# EAGLE board dc26-dev-board-apa102c (EAGLE 8.6.3)
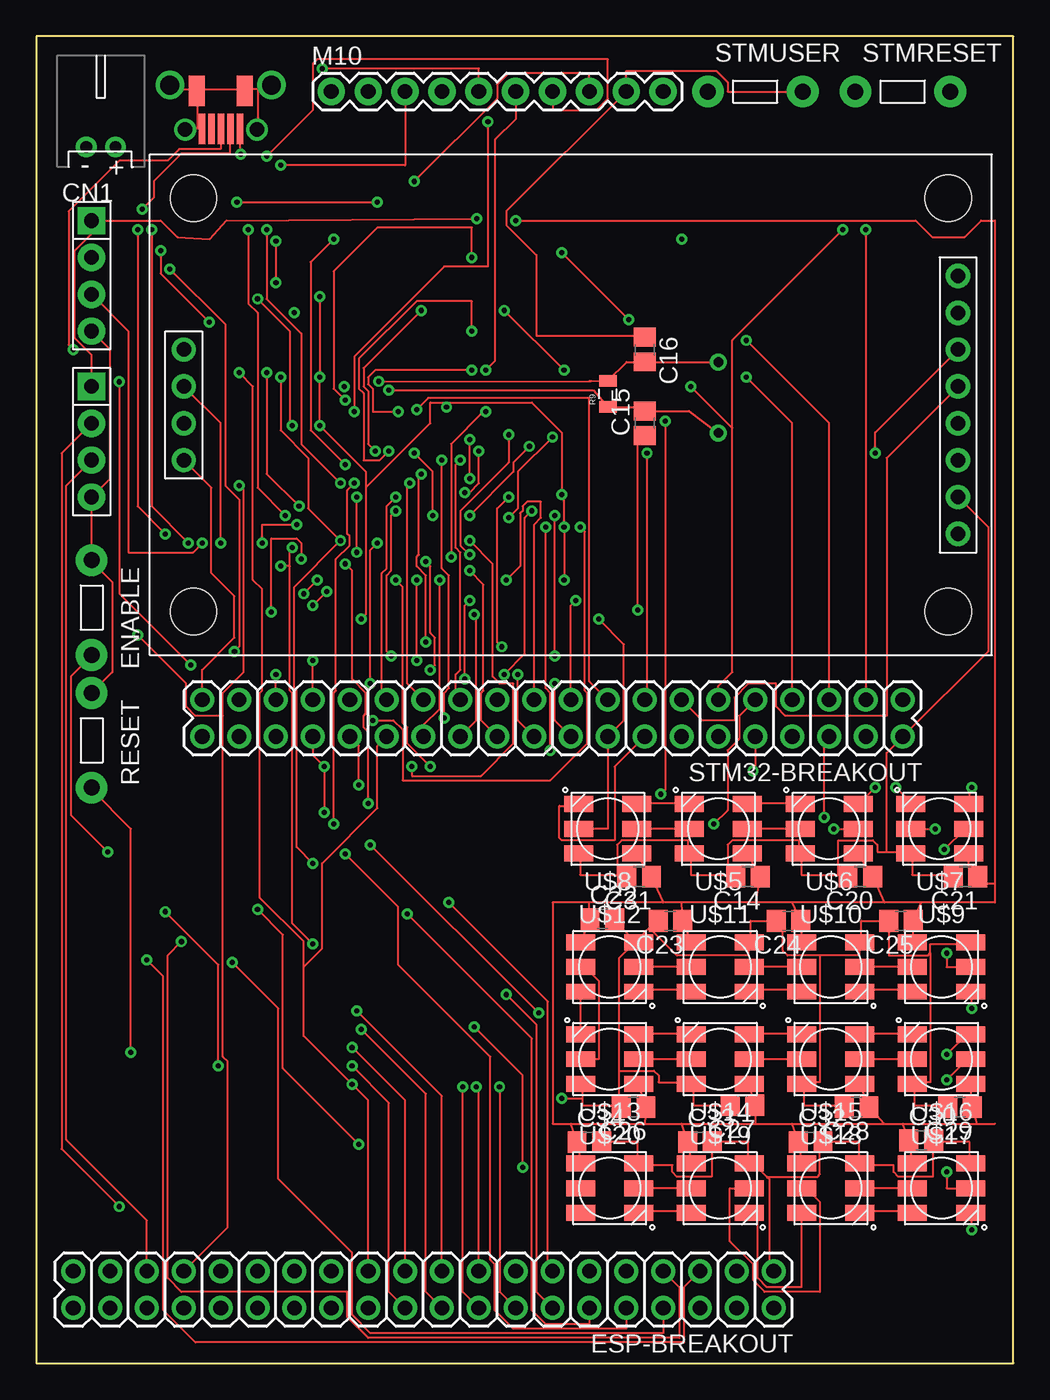
[diagram p7: board, top side]
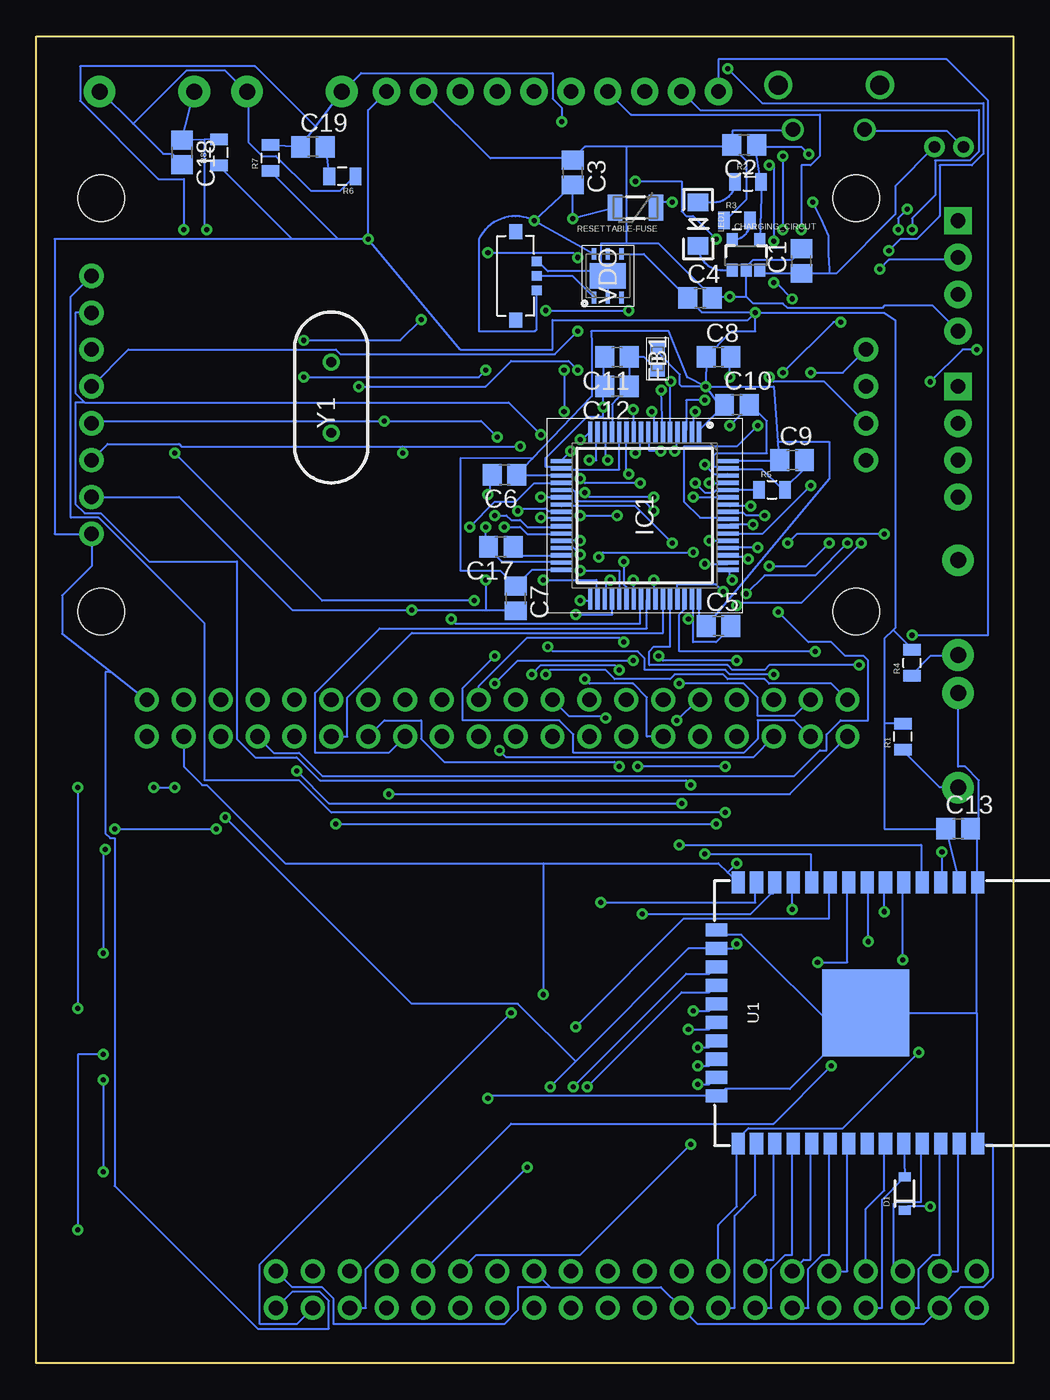
[diagram p8: board, bottom side, seen from below]

Size 67.31 x 91.44 mm. Coordinates in mm from the lower left corner, seen from the top.
Outline: 0,0 67.31,0 67.31,91.44 0,91.44 0,0
Copper layers (1*16): Top 0.035mm / dielectric 1.5mm / Bottom 0.035mm
Design rules "default": minimum track width 6mil, minimum drill 0.35mm, track to track 6mil, track to pad 6mil, pad to pad 6mil, via to via 6mil, smd to smd 6mil, copper to edge 40mil, drill to drill 6mil, minimum pad ring 10mil, minimum via ring 8mil, stop-mask expansion 4mil, vias tented up to drill 0mil, thermal gap 10mil

## Footprints (pad centres in the part's own frame; a part is rotated, then mirrored left to right if it is on the bottom)
C0805 = smd 1.3 x 1.5: 1 -0.85,0; 2 0.85,0
SOT23-5 = smd 0.75 x 0.9: 1 -0.95,-1; 2 0,-1; 3 0.95,-1; 4 0.95,1.1; 5 -0.95,1.1
JST-PH-2-THM-RA = drill 0.8 pad 1.422: 1 1,0; 2 -1,0
SOD-323 = smd 0.63 x 0.83: 1 -1.15,0; 2 1.15,0
TACTILE-2PIN-NARROW = drill 1.1 pad 2.184: P$1 3.264,0; P$2 -3.264,0
SERIAL_HEADER_4 = drill 1.016 pad 1.88: GND 3.81,0; RX -1.27,0; TX 1.27,0 | drill 1.016 pad 1.88 square: VCC -3.81,0
2X20 = drill 1.016 pad 1.651: 1 -24.13,-1.27; 2 -24.13,1.27; 3 -21.59,-1.27; 4 -21.59,1.27; 5 -19.05,-1.27; 6 -19.05,1.27; 7 -16.51,-1.27; 8 -16.51,1.27; 9 -13.97,-1.27; 10 -13.97,1.27; 11 -11.43,-1.27; 12 -11.43,1.27; 13 -8.89,-1.27; 14 -8.89,1.27; 15 -6.35,-1.27; 16 -6.35,1.27; 17 -3.81,-1.27; 18 -3.81,1.27; 19 -1.27,-1.27; 20 -1.27,1.27; 21 1.27,-1.27; 22 1.27,1.27; 23 3.81,-1.27; 24 3.81,1.27; 25 6.35,-1.27; 26 6.35,1.27; 27 8.89,-1.27; 28 8.89,1.27; 29 11.43,-1.27; 30 11.43,1.27; 31 13.97,-1.27; 32 13.97,1.27; 33 16.51,-1.27; 34 16.51,1.27; 35 19.05,-1.27; 36 19.05,1.27; 37 21.59,-1.27; 38 21.59,1.27; 39 24.13,-1.27; 40 24.13,1.27
BEADC1608X75N = smd 0.85 x 1: 1 -0.8,0; 2 0.8,0
QFP50P1200X1200X160-64N = smd 1.475 x 0.3: 1 -5.738,3.75; 2 -5.738,3.25; 3 -5.738,2.75; 4 -5.738,2.25; 5 -5.738,1.75; 6 -5.738,1.25; 7 -5.738,0.75; 8 -5.738,0.25; 9 -5.738,-0.25; 10 -5.738,-0.75; 11 -5.738,-1.25; 12 -5.738,-1.75; 13 -5.738,-2.25; 14 -5.738,-2.75; 15 -5.738,-3.25; 16 -5.738,-3.75; 33 5.738,-3.75; 34 5.738,-3.25; 35 5.738,-2.75; 36 5.738,-2.25; 37 5.738,-1.75; 38 5.738,-1.25; 39 5.738,-0.75; 40 5.738,-0.25; 41 5.738,0.25; 42 5.738,0.75; 43 5.738,1.25; 44 5.738,1.75; 45 5.738,2.25; 46 5.738,2.75; 47 5.738,3.25; 48 5.738,3.75 | smd 0.3 x 1.475: 17 -3.75,-5.738; 18 -3.25,-5.738; 19 -2.75,-5.738; 20 -2.25,-5.738; 21 -1.75,-5.738; 22 -1.25,-5.738; 23 -0.75,-5.738; 24 -0.25,-5.738; 25 0.25,-5.738; 26 0.75,-5.738; 27 1.25,-5.738; 28 1.75,-5.738; 29 2.25,-5.738; 30 2.75,-5.738; 31 3.25,-5.738; 32 3.75,-5.738; 49 3.75,5.738; 50 3.25,5.738; 51 2.75,5.738; 52 2.25,5.738; 53 1.75,5.738; 54 1.25,5.738; 55 0.75,5.738; 56 0.25,5.738; 57 -0.25,5.738; 58 -0.75,5.738; 59 -1.25,5.738; 60 -1.75,5.738; 61 -2.25,5.738; 62 -2.75,5.738; 63 -3.25,5.738; 64 -3.75,5.738
LED-1206 = smd 1.2 x 1.4: A -1.5,0; C 1.5,0
1X04 = drill 1.016 pad 1.88: GND 2.54,0; SWDCLK 0,0; SWDIO -2.54,0 | drill 1.016 pad 1.88 square: VCC -5.08,0
1X10 = drill 1.016 pad 1.88: 1 0,0; 2 2.54,0; 3 5.08,0; 4 7.62,0; 5 10.16,0; 6 12.7,0; 7 15.24,0; 8 17.78,0; 9 20.32,0; 10 22.86,0
SPDT_SSAJ120100 = smd 0.635 x 0.7: 1 -1,1.45; 2 1,1.45; C 0,1.45 | smd 1.05 x 0.9: MNT1 -3.05,0; MNT2 3.05,0
0805 = smd 0.8 x 1.2: 1 -0.9,0; 2 0.9,0
PTC-1206 = smd 1 x 1.8: 1 -1.4,0; 2 1.4,0
ESP-WROOM-32 = smd 0.9 x 1.5: 1 7.7,9; 2 6.43,9; 3 5.16,9; 4 3.89,9; 5 2.62,9; 6 1.35,9; 7 0.08,9; 8 -1.19,9; 9 -2.46,9; 10 -3.73,9; 11 -5,9; 12 -6.27,9; 13 -7.54,9; 14 -8.81,9; 25 -8.81,-9; 26 -7.54,-9; 27 -6.27,-9; 28 -5,-9; 29 -3.73,-9; 30 -2.46,-9; 31 -1.19,-9; 32 0.08,-9; 33 1.35,-9; 34 2.62,-9; 35 3.89,-9; 36 5.16,-9; 37 6.43,-9; 38 7.7,-9 | smd 1.5 x 0.9: 15 -10.3,5.715; 16 -10.3,4.445; 17 -10.3,3.175; 18 -10.3,1.905; 19 -10.3,0.635; 20 -10.3,-0.635; 21 -10.3,-1.905; 22 -10.3,-3.175; 23 -10.3,-4.445; 24 -10.3,-5.715 | smd 6 x 6: GND 0,0
ST7735S_LCD_DISPLAY = drill 1 pad 1.676: A0 1.27,-26.67; CS -3.81,-26.67; GND -6.35,-26.67; LED 8.89,-26.67; RESET -1.27,-26.67; SCK 6.35,-26.67; SD_CS -3.81,26.67; SD_MISO 1.27,26.67; SD_MOSI -1.27,26.67; SD_SCK 3.81,26.67; SDA 3.81,-26.67; VCC -8.89,-26.67 | hole 3.2: -14.25,26; 14.25,26; 14.25,-26; -14.25,-26
APA102_5050 = smd 2 x 1.1: 1 2,-1.7; 2 2,0; 3 2,1.7; 4 -2,1.7; 5 -2,0; 6 -2,-1.7
DX4R005JJ2 = smd 2.1 x 0.45: +5V 0.72,-1.32; D+ 0.72,-0.02; D- 0.72,-0.67; GND 0.72,1.28; ID 0.72,0.63 | smd 2.1 x 1.1: P$6 3.35,1.65; P$8 3.35,-1.65 | drill 1: P$7 0.675,2.45; P$9 0.675,-2.5 | drill 1.3: P$10 3.75,-3.5; P$11 3.75,3.5
SON95P300X300X90-7N = smd 0.8 x 0.3: 1 -1.5,0.95; 2 -1.5,0; 3 -1.5,-0.95; 4 1.5,-0.95; 5 1.5,0; 6 1.5,0.95 | smd 1.75 x 2.5: 7 0,0
HC/49US_(AT49)PTH = drill 0.66 pad 1.1: 1 -2.44,0; 2 2.44,0

## Placement (x,y rotation side)
C1  4.7uF  [C0805]  14.61,75.95 90 bottom
C2  4.7uf  [C0805]  18.54,83.95 180 bottom
C3  1uf  [C0805]  30.35,82.04 270 bottom
C4  1uf  [C0805]  21.59,73.41 0 bottom
C5  100nF  [C0805]  20.32,50.8 0 bottom
C6  100nF  [C0805]  35.05,61.21 180 bottom
C7  100nF  [C0805]  34.29,52.7 270 bottom
C8  4.7uF  [C0805]  20.32,69.34 0 bottom
C9  100nF  [C0805]  15.24,62.23 0 bottom
C10  100nF  [C0805]  19.05,66.04 0 bottom
C11  100nF  [C0805]  27.3,69.34 180 bottom
C12  1uF  [C0805]  27.3,67.31 180 bottom
C13  10uF  [C0805]  3.81,36.83 0 bottom
C14  15pf  [C0805]  49.02,33.53 180 top
C15  20pf  [C0805]  41.91,64.77 90 top
C16  20pf  [C0805]  41.91,69.85 270 top
C17  4.7uF  [C0805]  35.31,56.26 180 bottom
C18  100nF  [C0805]  57.28,83.44 270 bottom
C19  100nF  [C0805]  48.26,83.82 0 bottom
C20  15pf  [C0805]  56.77,33.53 180 top
C21  15pf  [C0805]  64.01,33.53 180 top
C22  15pf  [C0805]  38.99,30.61 0 top
C23  15pf  [C0805]  43.69,30.48 180 top
C24  15pf  [C0805]  51.82,30.48 180 top
C25  15pf  [C0805]  59.56,30.48 180 top
C26  15pf  [C0805]  41.15,17.65 180 top
C27  15pf  [C0805]  48.64,17.78 180 top
C28  15pf  [C0805]  56.52,17.65 180 top
C29  15pf  [C0805]  63.63,17.65 180 top
C30  15pf  [C0805]  60.96,15.37 0 top
C31  15pf  [C0805]  41.53,33.53 180 top
C32  15pf  [C0805]  53.34,15.24 0 top
C33  15pf  [C0805]  45.72,15.24 0 top
C34  15pf  [C0805]  38.1,15.24 0 top
CHARGING_CIRCUT  MCP73831  [SOT23-5]  18.41,76.33 0 bottom
CN1  JST  [JST-PH-2-THM-RA]  4.45,83.82 0 top
D1  1N4148WS  [SOD-323]  7.49,11.68 90 bottom
ENABLE  SW2  [TACTILE-2PIN-NARROW]  3.81,52.07 270 top
ESP32PH  SERIAL_4  [SERIAL_HEADER_4]  3.81,63.5 270 top
ESP-BREAKOUT  M20X2  [2X20]  26.67,5.08 180 top
FB1  BLM18TG221TN1D  [BEADC1608X75N]  24.51,69.22 270 bottom
IC1  STM32F411RET6  [QFP50P1200X1200X160-64N]  25.4,58.42 270 bottom
LED1  MF-LED-0603-GREEN  [LED-1206]  21.72,78.49 270 bottom
LINK1  STLINK-V2-CONNECTOR  [1X04]  3.81,73.66 270 top
M10  STM32-Breakout-2  [1X10]  20.32,87.63 0 top
P1  SSSS811101  [SPDT_SSAJ120100]  34.29,74.93 270 bottom
R1  10K  [0805]  7.62,43.18 90 bottom
R2  470  [0805]  18.29,81.41 0 bottom
R3  2k  [0805]  19.05,78.74 0 bottom
R4  10K  [0805]  6.99,48.26 90 bottom
R5  10K  [0805]  16.64,60.2 0 bottom
R6  100  [0805]  46.23,81.79 180 bottom
R7  4K7  [0805]  51.18,83.06 90 bottom
R8  4K7  [0805]  54.74,83.44 90 bottom
R9  1M  [0805]  39.37,66.8 90 top
RESET  SW1  [TACTILE-2PIN-NARROW]  3.81,42.93 270 top
RESETTABLE-FUSE  SSSS811101  [PTC-1206]  26.04,79.63 180 bottom
STM32-BREAKOUT  M20X2  [2X20]  35.56,44.45 180 top
STMRESET  MJTP1243  [TACTILE-2PIN-NARROW]  59.69,87.63 0 top
STMUSER  UserButton  [TACTILE-2PIN-NARROW]  49.53,87.63 0 top
U1  ESP-WROOM-32  [ESP-WROOM-32]  10.16,24.13 0 bottom
U$1  ST7735S_LCD_MODULE  [ST7735S_LCD_DISPLAY]  36.83,66.04 90 top
U$2  CMD_C0DE_LOGO  [CMD_C0DE_LOGO]  30.48,35.56 0 top
U$3  DARKNET_DD  [DARKNET_D]  60.96,3.81 0 top
U$4  DARKNET_NN  [DARKNET_N]  54.61,3.81 0 top
U$5  APA1025050  [APA102_5050]  46.99,36.83 0 top
U$6  APA1025050  [APA102_5050]  54.61,36.83 0 top
U$7  APA1025050  [APA102_5050]  62.23,36.83 0 top
U$8  APA1025050  [APA102_5050]  39.37,36.83 0 top
U$9  APA1025050  [APA102_5050]  62.36,27.3 180 top
U$10  APA1025050  [APA102_5050]  54.74,27.3 180 top
U$11  APA1025050  [APA102_5050]  47.12,27.3 180 top
U$12  APA1025050  [APA102_5050]  39.5,27.3 180 top
U$13  APA1025050  [APA102_5050]  39.5,20.95 0 top
U$14  APA1025050  [APA102_5050]  47.12,20.95 0 top
U$15  APA1025050  [APA102_5050]  54.74,20.95 0 top
U$16  APA1025050  [APA102_5050]  62.36,20.95 0 top
U$17  APA1025050  [APA102_5050]  62.36,12.06 180 top
U$18  APA1025050  [APA102_5050]  54.74,12.06 180 top
U$19  APA1025050  [APA102_5050]  47.12,12.06 180 top
U$20  APA1025050  [APA102_5050]  39.5,12.06 180 top
USB  DX4R005JJ2DX4R005JJ2  [DX4R005JJ2]  12.7,84.33 90 top
VDO  LD39100PU33RY  [SON95P300X300X90-7N]  27.94,74.93 90 bottom
Y1  ABL-8.000MHZ-B2  [HC/49US_(AT49)PTH]  46.99,66.55 90 bottom

## Tracks (layer width: path | path; a pad name or v marks a point on that pad's centre or on a via)
APA102_CLK  (via drill 0.35)
  Top 0.152: v38.73,51.28 40.48,49.53 40.48,44.29 STM32-BREAKOUT.18 39.37,36.83 U$8.5
  Bottom 0.152: v38.73,51.28 38.42,50.96 25.72,50.96 25.72,52.55 IC1.40
APA102_DATA
  Top 0.152: STM32-BREAKOUT.16 39.85,41.12 39.85,36.04 36.2,36.04 36.04,36.2 36.04,38.42 37.31,38.42 U$8.4
  Bottom 0.152: STM32-BREAKOUT.16 43.02,42.07 48.1,42.07 48.1,46.2 43.66,50.64 25.24,50.64 25.24,52.55 IC1.41
BOOT0  (via drill 0.35)
  Top 0.152: v21.91,60.64 21.43,60.17 21.43,57.15 21.59,56.99 21.59,56.36 20.64,55.4 20.64,46.35 20.48,46.2 v20.48,37.15 | v46.67,37.15 47.62,38.1 47.62,42.23 48.42,43.02 48.42,44.61 STM32-BREAKOUT.9
  Bottom 0.152: R5.1 17.57,60.17 IC1.60 19.68,60.17 20.48,60.17 20.64,60.01 21.27,60.01 v21.91,60.64 | v46.67,37.15 v20.48,37.15
CLK  (via drill 0.35)
  Top 0.152: v22.38,23.02 26.83,18.57 26.83,4.92 ESP-BREAKOUT.20
  Bottom 0.152: v22.38,23.02 20.95,23.02 20.48,23.49 U1.20
CMD  (via drill 0.35)
  Top 0.152: v22.07,24.29 27.94,18.41 ESP-BREAKOUT.19
  Bottom 0.152: v22.07,24.29 20.95,24.29 20.48,24.77 U1.19
ESP-EN  (via drill 0.35)
  Top 0.152: v4.92,35.24 2.38,37.78 2.38,47.31 3.81,48.74 ENABLE.P$1
  Bottom 0.152: R4.1 6.99,47.47 5.71,48.74 3.81,48.74 ENABLE.P$1 | v4.92,35.24 4.92,33.18 U1.3
ESP-IO0  (via drill 0.35)
  Top 0.152: v6.51,21.43 6.51,36.83 3.81,39.53 RESET.P$1
  Bottom 0.152: R1.1 7.62,42.23 5.08,39.69 3.81,39.69 RESET.P$1 | ESP-BREAKOUT.25 20.32,9.52 19.05,10.79 19.05,15.08 U1.25 18.89,15.24 18.89,15.56 18.26,16.19 11.75,16.19 v6.51,21.43
ESP-RX  (via drill 0.35)
  Top 0.152: v5.71,10.79 1.75,14.76 1.75,62.71 ESP32PH.RX
  Bottom 0.152: v5.71,10.79 7.3,10.79 7.46,10.64 D1.1
ESP-RX0
  Bottom 0.152: U1.34 D1.2 7.62,12.7 9.05,11.27 9.05,3.81 ESP-BREAKOUT.34
ESP-TX0
  Top 0.152: ESP32PH.TX 2.06,60.48 2.06,15.4 7.62,9.84 ESP-BREAKOUT.35
  Bottom 0.152: ESP-BREAKOUT.35 8.26,6.35 8.26,10.95 8.1,11.11 6.35,11.11 6.35,15.08 U1.35
ESP_CS  (via drill 0.35)
  Top 0.152: v13.97,60.48 14.29,60.17 14.29,47.62 12.86,46.2 12.86,44.61 | 12.86,44.61 12.86,21.11 13.18,20.8 13.18,9.37 ESP-BREAKOUT.33 | v6.99,50.16 10.32,46.83 10.32,45.24 10.95,44.61 12.86,44.61
  Bottom 0.152: v13.97,60.48 17.3,57.15 19.53,57.15 IC1.54 | ESP-BREAKOUT.33 10.16,10.64 8.89,11.91 8.89,15.08 U1.33 | M10.1 20.32,89.85 4.6,89.85 1.75,87 1.75,50.16 v6.99,50.16
GND  (via drill 0.35)
  Top 0.152: 40.01,33.66 37.47,33.66 37.47,35.08 U$8.6 | 40.01,33.66 40.64,33.66 C31.2 | 47.62,33.66 45.09,33.66 45.09,35.08 U$5.6 44.93,35.24 44.93,36.04 40.32,36.04 40.01,35.72 40.01,33.66 | 47.62,33.66 48.1,33.66 C14.2 47.62,33.66 | C21.2 63.02,33.66 60.33,33.66 60.33,35.08 U$7.6 60.17,35.24 58.58,35.24 | 55.24,33.66 52.7,33.66 52.7,35.08 U$6.6 52.55,35.24 52.55,36.04 47.94,36.04 47.62,35.72 47.62,33.66 | 55.24,33.66 55.88,33.66 C20.2 | 58.58,35.24 57.94,35.24 57.94,35.72 57.63,36.04 55.24,36.04 55.24,33.66 | 58.58,35.24 58.58,42.07 STM32-BREAKOUT.2 65.56,49.05 65.56,57.63 U$1.GND | v41.43,51.91 41.43,63.34 41.91,63.82 C15.1 | C16.1 41.91,70.8 34.45,70.8 34.45,76.36 32.38,78.42 32.38,79.38 M10.9 40.64,89.06 46.83,89.06 47.62,88.27 47.62,87.63 STMUSER.P$1 | v22.38,51.28 22.7,51.59 22.7,60.33 | 22.7,60.33 22.7,61.44 v19.53,64.61 v19.53,67.94 v19.53,73.5 | 28.26,66.2 27.15,66.2 27.15,64.77 22.7,60.33 | 28.26,66.2 34.13,66.2 36.2,64.14 v36.2,59.85 36.35,59.69 v36.35,57.63 v36.35,53.98 | 28.26,66.2 v28.26,65.88 | 15.24,87.79 16.19,87.79 16.19,87.95 USB.P$10 15.24,87.79 | 15.24,87.79 14.45,87.79 USB.P$8 14.29,87.79 11.11,87.79 USB.P$6 | 15.24,87.79 15.24,85.09 USB.P$9 | USB.P$6 10.95,87.79 9.21,87.79 9.21,87.95 USB.P$11 | 11.11,85.09 10.32,85.09 USB.P$7 | 11.11,85.09 11.27,85.09 USB.GND | 11.11,85.09 11.11,87.63 USB.P$6 | 42.23,30 41.59,29.37 41.59,29.05 U$12.6 | 42.23,30 42.7,30.48 C23.2 42.23,30 | 41.27,29.05 41.43,28.89 U$12.6 | 41.27,29.05 39.85,30.48 C22.2 | C27.2 45.24,17.78 45.24,19.21 U$14.6 45.09,19.37 42.86,19.37 42.86,19.84 42.55,20.16 40.16,20.16 | 40.16,17.78 37.62,17.78 37.62,18.26
  Top 0.152: 37.62,18.26 37.62,19.21 U$13.6 | 40.16,17.78 40.16,20.16 | 40.16,17.78 C26.2 | 41.27,29.05 40.16,27.94 40.16,20.16 | 41.27,29.05 U$12.6 | C28.2 55.56,17.78 52.86,17.78 52.86,19.21 U$15.6 52.86,19.37 53.98,19.37 53.98,28.1 | C29.2 62.71,17.78 60.48,17.78 60.48,19.21 U$16.6 60.48,19.37 61.59,19.37 61.59,28.26 | 61.59,28.26 61.59,28.89 64.29,28.89 U$9.6 | 61.59,28.26 61.44,28.1 58.74,28.1 58.74,30.48 C25.2 56.83,30.48 56.83,29.05 U$10.6 56.67,28.89 56.67,28.1 53.98,28.1 | 53.98,28.1 51.75,28.1 51.44,28.42 51.44,30.16 51.12,30.48 C24.2 49.21,30.48 49.21,29.05 U$11.6 49.05,28.89 49.05,28.1 44.13,28.1 42.23,30 | U$17.6 64.29,13.81 64.29,15.24 61.91,15.24 C30.2 61.75,15.24 61.75,12.86 59.37,12.86 59.05,13.18 59.05,13.65 56.83,13.65 U$18.6 56.67,13.81 56.67,15.24 C32.2 54.13,15.24 53.98,15.08 53.98,13.02 53.82,12.86 50.32,12.86 | C34.2 41.43,15.24 41.43,13.81 U$20.6 41.59,13.65 43.81,13.65 43.81,13.18 44.13,12.86 46.51,12.86 46.51,15.24 C33.2 49.05,15.24 49.05,14.13 | 49.05,14.13 49.05,13.81 U$19.6 49.05,14.13 | ESP-BREAKOUT.1 50.48,6.67 50.48,12.7 50.32,12.86 | 49.05,14.13 50.32,12.86 | LINK1.GND 5.08,69.85 5.08,60.96 ESP32PH.GND ENABLE.P$2 3.81,55.25 5.24,53.82 5.24,47.62 RESET.P$2 | v36.2,18.26 37.62,18.26
  Bottom 0.152: 36.35,51.91 v41.43,51.91 49.69,51.91 57.47,59.69 U$1.GND | 36.35,51.91 34.29,51.91 C7.2 | 60.64,85.41 62.87,87.63 STMRESET.P$1 | 60.64,85.41 58.58,83.34 57.94,83.34 57.31,82.71 C18.2 | R6.1 45.4,81.76 46.35,80.8 48.42,80.8 50.8,83.19 51.75,83.19 52.7,84.14 52.7,87.63 STMUSER.P$1 52.86,87.63 54.29,89.06 56.99,89.06 60.64,85.41 | 28.26,67.31 28.26,69.22 C11.2 | IC1.12 27.15,64.14 27.15,61.59 31.11,61.59 IC1.18 31.27,61.75 32.23,61.75 32.23,62.39 29.37,65.25 28.26,65.25 v28.26,65.88 28.26,67.31 | 28.26,67.31 C12.2 | IC1.31 31.27,55.25 35.24,55.25 36.2,56.2 C17.2 36.2,56.36 36.35,56.36 v36.35,57.63 | v36.2,59.85 36.04,59.85 36.04,61.12 C6.2 | 22.07,51.28 22.07,49.69 20.48,49.69 19.37,50.8 C5.2 | 22.07,51.28 22.07,52.55 IC1.47 | C9.2 14.45,62.23 14.45,61.59 15.72,60.33 R5.2 15.88,60.33 16.03,60.33 17.3,61.59 19.53,61.59 IC1.63 19.68,61.75 20.64,61.75 20.64,62.55 20.48,62.71 16.99,62.71 16.99,64.93 18.1,66.04 | v19.53,67.94 19.53,69.22 C8.2 | 18.1,66.04 v19.53,64.61 | 18.1,66.04 C10.2 | v22.38,51.28 22.07,51.28 | 28.42,75.25 28.26,75.25 VDO.7 | 28.42,75.25 32.07,75.25 32.7,75.88 P1.1 | VDO.7 VDO.2 | 18.41,73.5 CHARGING_CIRCUT.2 18.41,75.56 17.94,76.04 15.24,76.04 14.61,76.68 C1.2 | 18.41,73.5 v19.53,73.5 20.64,73.5 C4.2 20.8,73.5 24.45,77.15 26.67,77.15 | 28.42,75.25 28.42,77.15 26.67,77.15 | 28.42,75.25 VDO.7 | R3.1 19.84,78.74 18.41,80.17 18.41,82.87 19.37,83.82 C2.2 | 26.67,83.82 19.53,83.82 C2.2 | 26.67,83.82 29.53,83.82 30.32,83.03 C3.1 30.48,83.03 36.04,83.03 M10.9 | CN1.2 3.49,83.82 4.6,84.93 10.16,84.93 USB.P$7 | C2.2 19.37,83.98 19.37,84.93 15.24,84.93 USB.P$9
  Bottom 0.152: 26.67,83.82 26.67,77.15 | v36.35,53.98 36.35,51.91 | 31.91,5.24 24.29,5.24 ESP-BREAKOUT.24 21.75,2.7 6.19,2.7 ESP-BREAKOUT.38 3.65,5.24 2.06,5.24 1.43,5.87 1.43,15.08 2.38,15.08 U1.38 2.54,15.24 2.54,24.13 | ESP-BREAKOUT.15 31.91,5.24 | 2.54,36.83 2.54,33.18 U1.1 2.54,33.02 2.54,24.13 | 2.54,36.83 C13.2 2.86,36.83 | 2.54,24.13 U1.GND 11.75,22.54 | 11.75,22.54 15.4,18.89 19.84,18.89 20.32,18.41 U1.24 36.04,18.41 v36.2,18.26 | 11.75,22.54 18.73,29.53 20,29.53 20.32,29.84 U1.15 | RESET.P$2 3.81,41.12 3.33,41.12 2.38,40.16 2.38,36.83 2.54,36.83 | ESP-BREAKOUT.1 49.69,5.24 47.62,5.24 46.83,4.45 46.83,2.7 35.08,2.7 34.13,3.65 34.13,5.24 31.91,5.24 | 18.41,73.5 17.94,73.03 15.88,73.03 15.56,72.71 9.05,72.71 8.89,72.87 5.56,72.87 LINK1.GND
IO4
  Bottom 0.152: ESP-BREAKOUT.26 19.21,3.81 19.21,10.16 17.78,11.59 17.78,15.08 U1.26
IO5
  Bottom 0.152: ESP-BREAKOUT.29 14.45,7.14 13.97,7.14 13.97,15.08 U1.29
IO14  (via drill 0.35)
  Top 0.152: v28.42,31.75 35.24,24.92 35.24,6.67 ESP-BREAKOUT.13
  Bottom 0.152: v28.42,31.75 17.78,31.75 17.78,33.02 U1.13
IO16
  Bottom 0.152: ESP-BREAKOUT.27 16.99,7.14 16.51,7.14 16.51,15.08 U1.27
IO17
  Bottom 0.152: ESP-BREAKOUT.28 16.67,3.81 16.67,6.51 15.72,7.46 15.24,7.46 15.24,15.08 U1.28
IO18
  Bottom 0.152: ESP-BREAKOUT.30 14.13,3.81 14.13,6.51 13.18,7.46 12.7,7.46 12.7,15.08 U1.30
IO19
  Bottom 0.152: ESP-BREAKOUT.31 11.43,6.35 11.43,15.08 U1.31
IO22
  Bottom 0.152: ESP-BREAKOUT.36 6.51,3.81 6.51,6.51 5.56,7.46 5.08,7.46 5.08,15.08 U1.36
IO23
  Bottom 0.152: ESP-BREAKOUT.37 3.81,6.35 3.81,15.08 U1.37
IO25  (via drill 0.35)
  Top 0.152: v21.27,35.08 24.92,31.43 24.92,27.46 31.27,21.11 31.27,7.14 31.59,6.83 31.59,3.65 32.86,2.38 40.64,2.38 ESP-BREAKOUT.10
  Bottom 0.152: v21.27,35.08 13.97,35.08 13.97,33.18 U1.10
IO26  (via drill 0.35)
  Top 0.152: v15.24,31.27 16.99,29.53 16.99,20.32 v22.23,15.08
  Bottom 0.152: v15.24,31.27 15.24,33.02 U1.11 | v22.23,15.08 29.84,7.46 36.99,7.46 ESP-BREAKOUT.11
IO27  (via drill 0.35)
  Top 0.152: v25.56,30.96 34.13,22.38 34.13,3.65 35.08,2.7 38.1,2.7 ESP-BREAKOUT.12
  Bottom 0.152: v25.56,30.96 18.1,30.96 16.67,32.38 16.51,32.38 16.51,33.02 U1.12
IO32  (via drill 0.35)
  Top 0.152: v13.49,27.62 16.67,24.45 16.67,12.7 21.75,7.62 21.75,3.33 23.02,2.06 43.18,2.06 ESP-BREAKOUT.8
  Bottom 0.152: v13.49,27.62 11.43,27.62 11.43,33.02 U1.8
IO33  (via drill 0.35)
  Top 0.152: v30.16,23.18 33.5,19.84 v33.5,13.49
  Bottom 0.152: v30.16,23.18 22.7,30.64 12.7,30.64 12.7,33.02 U1.9 | ESP-BREAKOUT.9 v33.5,13.49
IO34  (via drill 0.35)
  Top 0.152: v8.89,31.12 12.54,27.46 v12.54,20.48
  Bottom 0.152: v8.89,31.12 8.89,33.02 U1.6 | v12.54,20.48 16.51,16.51 34.61,16.51 44.61,6.51 44.61,3.81 ESP-BREAKOUT.6
IO35  (via drill 0.35)
  Top 0.152: v10,29.05 9.05,28.1 9.05,5.87 10,4.92 21.43,4.92 21.43,3.17 22.86,1.75 44.29,1.75 44.29,5.24 ESP-BREAKOUT.7
  Bottom 0.152: v10,29.05 10,33.02 U1.7
LCD_BACKLIGHT  (via drill 0.35)
  Top 0.152: v29.84,56.67 31.43,55.09 31.43,47.31 31.91,46.83 32.86,46.83 32.86,42.7 30.64,40.48 25.88,40.48 v25.88,41.12 | STM32-BREAKOUT.34 19.05,41.91 v19.84,41.12 v19.84,37.94
  Bottom 0.152: v29.84,56.67 31.11,56.67 IC1.28 | v19.84,41.12 v25.88,41.12 | U$1.LED 64.93,73.5 64.93,58.26 63.02,58.26 55.72,50.96 55.72,40.16 49.21,40.16 46.99,37.94 v19.84,37.94
LCD_CS  (via drill 0.35)
  Top 0.152: v26.04,62.71 27.3,61.44 v27.3,58.42 | v29.84,58.42 32.86,61.44 32.86,62.07 v33.97,63.18 | STM32-BREAKOUT.15 42.07,45.88 v42.07,62.71
  Bottom 0.152: v26.04,62.71 25.72,62.71 25.72,64.14 IC1.9 | v29.84,58.42 v27.3,58.42 | 42.07,63.18 57.31,63.18 57.47,63.34 62.39,63.34 U$1.CS | 42.07,63.18 v33.97,63.18 | 42.07,63.18 v42.07,62.71
LCD_DATA_CMD  (via drill 0.35)
  Top 0.152: v24.29,62.86 23.65,62.23 22.54,62.23 22.54,66.83 22.23,67.15 22.23,69.22 26.19,73.18 30,73.18 v30,71.12 | STM32-BREAKOUT.13 45.88,44.29 48.1,44.29 48.1,45.88 49.05,46.83 50.96,46.83 50.96,45.24 51.59,44.61 58.58,44.61 58.58,62.39 U$1.A0
  Bottom 0.152: v24.29,62.86 25.08,62.86 25.08,64.14 IC1.8 | v30,71.12 31.59,69.53 46.35,69.53 46.67,69.85 60.96,69.85 U$1.A0
LCD_RESET  (via drill 0.35)
  Top 0.152: v32.54,58.26 33.18,58.9 33.18,61.44 v35.56,63.82 | v43.02,39.21 43.34,39.53 v43.34,64.93
  Bottom 0.152: v32.54,58.26 31.27,58.26 IC1.25 | v35.56,63.82 36.67,64.93 v43.34,64.93 63.34,64.93 U$1.RESET | STM32-BREAKOUT.40 15.4,39.21 v43.02,39.21
N$1
  Bottom 0.152: R2.1 arc90 20.61,79.99 LED1.A
N$2
  Bottom 0.152: CHARGING_CIRCUT.5 arc-90 18.15,78.52 R3.2
N$3
  Bottom 0.152: LED1.C arc-90 20.06,75.33 CHARGING_CIRCUT.1
N$4
  Bottom 0.152: C19.2 R6.2
N$5
  Top 0.152: U$5.5 U$8.2
N$6
  Top 0.152: U$6.5 U$5.2
N$7  (via drill 0.35)
  Top 0.152: v54.93,36.83 U$6.2 | U$7.5 v61.91,36.83
  Bottom 0.152: v61.91,36.83 v54.93,36.83
N$8  (via drill 0.35)
  Top 0.152: v57.78,39.69 56.67,38.58 U$6.3 | v59.21,39.69 60.17,38.73 60.17,38.58 U$7.4
  Bottom 0.152: v59.21,39.69 v57.78,39.69
N$9
  Top 0.152: U$5.3 49.05,38.58 52.55,38.58 U$6.4
N$10
  Top 0.152: U$8.3 41.43,38.58 44.93,38.58 U$5.4
N$11  (via drill 0.35)
  Top 0.152: v64.45,24.45 64.45,25.56 U$9.4 | v64.45,39.69 64.29,39.53 64.29,38.58 U$7.3
  Bottom 0.152: v64.45,39.69 v64.45,24.45
N$12  (via drill 0.35)
  Top 0.152: U$9.5 62.71,27.3 v62.71,28.26 | v62.55,35.4 63.98,36.83 U$7.2
  Bottom 0.152: v62.71,28.26 62.71,35.4 v62.55,35.4
N$13
  Top 0.152: U$9.2 U$10.5
N$14
  Top 0.152: U$10.4 56.83,25.72 60.33,25.72 U$9.3
N$15
  Top 0.152: U$10.2 U$11.5
N$16
  Top 0.152: U$11.4 49.21,25.72 52.7,25.72 U$10.3
N$17
  Top 0.152: U$11.2 U$12.5
N$18
  Top 0.152: U$12.4 41.59,25.72 45.09,25.72 U$11.3
N$19
  Top 0.152: U$13.5 38.73,20.95 38.73,26.35 37.78,27.3 U$12.2
N$20
  Bottom 0.152: C17.1 33.87,55.67 IC1.30
N$21
  Top 0.152: U$13.4 37.47,22.7 37.47,25.56 U$12.3
N$22
  Top 0.152: U$14.5 U$13.2
N$23
  Top 0.152: U$13.3 41.59,22.7 45.09,22.7 U$14.4
N$24
  Top 0.152: U$15.5 U$14.2
N$25
  Top 0.152: U$14.3 49.21,22.7 52.7,22.7 U$15.4
N$26
  Top 0.152: U$16.5 U$15.2
N$27
  Top 0.152: U$15.3 56.83,22.7 60.33,22.7 U$16.4
N$28  (via drill 0.35)
  Top 0.152: v64.45,9.21 64.45,10.32 U$17.4 | v62.71,21.27 63.98,22.54 64.29,22.54 U$16.3
  Bottom 0.152: v64.45,9.21 64.45,21.27 v62.71,21.27
N$29  (via drill 0.35)
  Top 0.152: U$17.5 62.71,12.06 v62.71,13.18 | v62.71,19.53 64.14,20.95 U$16.2
  Bottom 0.152: v62.71,19.53 v62.71,13.18
N$30
  Top 0.152: U$18.4 56.83,10.48 60.33,10.48 U$17.3
N$31
  Top 0.152: U$17.2 U$18.5
N$32
  Top 0.152: U$19.5 47.78,12.06 47.78,8.41 49.37,6.83 49.37,5.71 50.16,4.92 53.98,4.92 53.98,11.11 53.02,12.06 U$18.2
N$33
  Top 0.152: U$19.4 49.21,10.32 49.69,9.84 49.69,5.87 50.32,5.24 52.7,5.24 52.7,10.32 U$18.3
N$34
  Top 0.152: U$19.2 U$20.5
N$35
  Top 0.152: U$20.4 41.59,10.48 45.09,10.48 U$19.3
NRST  (via drill 0.35)
  Top 0.152: v24.92,65.56 23.18,65.56 23.18,67.15 22.86,67.47 22.86,67.94 23.34,68.42 v30,68.42 | 47.94,64.45 v45.09,67.31 | 47.94,64.45 47.94,47.62 46.99,46.67 STM32-BREAKOUT.11 | v55.56,78.11 47.94,70.48 47.94,64.45
  Bottom 0.152: R8.2 55.72,84.32 | 55.72,84.32 C18.1 STMRESET.P$2 | v24.92,65.56 24.77,65.56 24.77,64.29 IC1.7 | v30,68.42 30.64,69.06 34.61,69.06 36.35,67.31 v45.09,67.31 | v55.56,78.11 55.72,78.11 55.72,84.3 55.72,84.32
OSC_IN  (via drill 0.35)
  Top 0.152: v23.59,67.66 38.1,67.69 | 38.1,67.69 38.23,67.69 | 38.1,67.69 R9.2 40.67,69 C16.2 46.47,69 Y1.2
  Bottom 0.152: IC1.5 23.62,67.31 | 23.62,67.31 23.62,67.69 | 23.62,67.31 v23.59,67.66
OSC_OUT  (via drill 0.35)
  Top 0.152: v24.27,67.05 38.35,67.06 R9.1 41.63,65.9 C15.2 44.97,65.62 Y1.1
  Bottom 0.152: IC1.6 v24.27,67.05
PA0  (via drill 0.35)
  Top 0.152: v27.94,62.23 27.94,54.77 28.42,54.29 28.42,46.51 28.1,46.2 v28.1,44.45
  Bottom 0.152: v27.94,62.23 28.1,62.23 28.1,64.14 IC1.14 | v28.1,44.45 28.26,44.61 30.64,44.61 STM32-BREAKOUT.23
PA1  (via drill 0.35)
  Top 0.152: v29.21,62.23 28.89,61.91 28.89,56.2 29.21,55.88 29.21,47.78 28.89,47.47 28.89,46.04 STM32-BREAKOUT.25
  Bottom 0.152: v29.21,62.23 28.73,62.23 28.73,64.14 IC1.15
PA2  (via drill 0.35)
  Top 0.152: v29.84,60.96 v29.84,63.66 | v25.72,60.64 25.56,60.48 25.56,46.83 STM32-BREAKOUT.27
  Bottom 0.152: v29.84,63.66 29.69,63.66 29.21,64.14 IC1.16 | v29.84,60.96 29.53,60.64 v25.72,60.64
PA3  (via drill 0.35)
  Top 0.152: v30.48,62.86 30.48,60.64 29.84,60.01 v29.53,60.01 | v24.77,59.69 24.13,59.05 24.13,54.77 23.81,54.45 23.81,46.04 STM32-BREAKOUT.29
  Bottom 0.152: v30.48,62.86 31.11,62.23 IC1.17 | v29.53,60.01 29.21,59.69 v24.77,59.69
PA4  (via drill 0.35)
  Top 0.152: v37.47,57.63 37.78,57.31 37.78,46.35 37.94,46.2 37.94,42.7 35.4,40.16 25.24,40.16 25.24,43.66 24.61,44.29 v23.18,44.29
  Bottom 0.152: v37.47,57.63 35.72,59.37 34.29,59.37 33.02,60.64 31.27,60.64 IC1.20 | v23.18,44.29 21.75,45.72 STM32-BREAKOUT.31
PA5  (via drill 0.35)
  Top 0.152: v24.77,58.74 24.45,58.42 24.45,54.61 24.13,54.29 24.13,49.05 v24.45,48.74 | STM32-BREAKOUT.33 v19.05,48.42
  Bottom 0.152: v24.77,58.74 25.4,59.37 30.16,59.37 30.16,60.01 30.32,60.17 31.11,60.17 IC1.21 | v24.45,48.74 24.13,48.42 v19.05,48.42
PA6  (via drill 0.35)
  Top 0.152: v32.54,59.69 31.75,58.9 31.75,49.69 v32.07,49.37 | STM32-BREAKOUT.35 v16.51,47.47
  Bottom 0.152: v32.54,59.69 31.27,59.69 IC1.22 | v32.07,49.37 31.75,49.05 25.88,49.05 25.4,48.58 25.4,47.78 19.84,47.78 19.53,47.47 v16.51,47.47
PA7  (via drill 0.35)
  Top 0.152: v23.5,56.52 23.02,56.04 v23.02,46.83
  Bottom 0.152: v23.5,56.52 26.04,59.05 31.11,59.05 IC1.23 | v23.02,46.83 18.57,46.83 17.62,45.88 17.62,44.61 15.08,44.61 STM32-BREAKOUT.37
PA15  (via drill 0.35)
  Top 0.152: v21.27,55.09 21.75,54.61 21.75,47.15 22.7,46.2 22.7,44.77 22.54,44.61 22.54,43.81 22.86,43.5 v22.86,38.58 | v49.37,40.8 49.53,40.96 STM32-BREAKOUT.10
  Bottom 0.152: v21.27,55.09 19.68,55.09 IC1.50 | v22.86,38.58 47.15,38.58 v49.37,40.8
PB0  (via drill 0.35)
  Top 0.152: v35.72,48.74 v35.72,58.42
  Bottom 0.152: v35.72,58.42 34.92,58.42 34.61,58.1 33.97,58.1 33.5,57.63 31.27,57.63 IC1.26 | v35.72,48.74 37.94,46.51 37.94,44.29 31.27,44.29 30.32,43.34 30.32,42.07 18.57,42.07 17.62,43.02 17.62,44.29 15.08,44.29 STM32-BREAKOUT.38
PB1  (via drill 0.35)
  Top 0.152: v35.08,57.63 35.08,46.51 35.4,46.2 v35.4,42.23
  Bottom 0.152: v35.08,57.63 33.97,57.63 33.5,57.15 31.27,57.15 IC1.27 | v35.4,42.23 34.92,41.75 17.94,41.75 STM32-BREAKOUT.36
PB3  (via drill 0.35)
  Top 0.152: v17.94,57.78 15.56,57.78 v15.56,56.52 | v8.89,57.15 6.99,59.05 v6.99,78.11
  Bottom 0.152: v17.94,57.78 19.53,57.78 IC1.55 | v15.56,56.52 14.92,57.15 v8.89,57.15 | v6.99,78.11 6.99,78.9 5.4,80.49 5.4,82.87 3.02,82.87 2.38,83.5 2.38,86.36 21.59,86.36 M10.2
PB4  (via drill 0.35)
  Top 0.152: v17.62,64.61 17.46,64.77 17.46,71.12 v15.24,73.34 | v16.51,77.31 v16.51,74.45 | v16.83,82.55 25.4,82.55 M10.3
  Bottom 0.152: v17.62,64.61 19.05,63.18 22.7,63.18 22.7,59.37 21.59,58.26 19.68,58.26 IC1.56 | v15.24,73.34 16.35,74.45 v16.51,74.45 | v16.51,77.31 16.51,82.55 v16.83,82.55
PB5  (via drill 0.35)
  Top 0.152: v17.14,58.42 15.24,60.33 15.24,72.39 14.61,73.03 v14.61,78.11
  Bottom 0.152: v17.14,58.42 18.41,58.42 18.57,58.58 19.53,58.58 IC1.57 | v14.61,78.11 14.61,82.55 13.97,82.55 13.34,83.19 13.34,86.04 26.35,86.04 M10.4
PB6  (via drill 0.35)
  Top 0.152: v18.1,59.05 15.88,61.28 v15.88,68.26 | v11.91,71.75 8.57,75.09 v8.57,76.68 | v19.68,89.22 30.48,89.22 M10.5
  Bottom 0.152: v18.1,59.05 19.53,59.05 IC1.58 | v15.88,68.26 12.38,71.75 v11.91,71.75 | v8.57,76.68 7.78,77.47 6.67,77.47 5.08,79.06 5.08,82.55 2.86,82.55 2.06,83.34 2.06,86.84 17.3,86.84 v19.68,89.22
PB7  (via drill 0.35)
  Top 0.152: v22.07,55.88 v22.07,59.69 | v28.57,55.56 28.57,63.34 30.8,65.56 v30.96,65.56 | v30.96,68.42 31.59,69.06 31.59,84.3 33.02,85.72 M10.6
  Bottom 0.152: v22.07,59.69 19.68,59.69 IC1.59 | v22.07,55.88 28.26,55.88 v28.57,55.56 | v30.96,68.42 v30.96,65.56
PB8  (via drill 0.35)
  Top 0.152: v20.95,60.64 18.26,63.34 18.26,70.96 15.88,73.34 v15.88,78.11 | v15.88,83.19 19.05,86.36 19.05,89.53 19.37,89.85 39.37,89.85 39.37,87.15 38.58,86.36 35.56,86.36 M10.7
  Bottom 0.152: v20.95,60.64 19.68,60.64 IC1.61 | v15.88,83.19 v15.88,78.11
PB9  (via drill 0.35)
  Top 0.152: v21.27,61.91 18.89,64.29 18.89,75.88 v20.48,77.47 | v26.04,81.44 31.75,87.15 31.75,88.11 32.54,88.9 38.1,88.9 M10.8
  Bottom 0.152: v21.27,61.91 20.64,61.28 19.68,61.28 IC1.62 | v20.48,77.47 22.07,79.06 22.54,79.06 22.86,79.38 22.86,81.44 v26.04,81.44
PB13  (via drill 0.35)
  Top 0.152: v32.38,53.98 33.34,54.93 33.34,58.58 33.5,58.74 33.5,59.05 33.81,59.37 34.77,59.37 34.77,58.26 34.29,57.78 STM32-BREAKOUT.21
  Bottom 0.152: v32.38,53.98 28.73,53.98 28.73,52.7 IC1.34
PB14  (via drill 0.35)
  Top 0.152: v27.78,53.98 27.78,45.09 26.67,43.97 STM32-BREAKOUT.28
  Bottom 0.152: v27.78,53.98 28.1,53.98 28.1,52.7 IC1.35
PB15  (via drill 0.35)
  Top 0.152: v30.16,51.59 30.32,51.44 30.32,44.29 STM32-BREAKOUT.26
  Bottom 0.152: v30.16,51.59 27.62,51.59 27.62,52.55 IC1.36
PC2  (via drill 0.35)
  Top 0.152: v26.19,65.72 26.99,66.52 38.1,66.52 38.1,46.99 STM32-BREAKOUT.17
  Bottom 0.152: v26.19,65.72 26.19,64.29 IC1.10
PC6  (via drill 0.35)
  Top 0.152: v29.84,54.61 30.8,53.66 30.8,46.35 30.64,46.2 30.64,44.29 STM32-BREAKOUT.24
  Bottom 0.152: v29.84,54.61 27.15,54.61 27.15,52.7 IC1.37
PC7  (via drill 0.35)
  Top 0.152: v26.83,55.25 27.15,54.93 27.15,50.32 27.46,50.01 27.46,48.1 v27.15,47.78 | v33.18,47.47 33.18,44.29 STM32-BREAKOUT.22
  Bottom 0.152: v26.83,55.25 26.83,53.66 26.67,53.5 26.67,52.7 IC1.38 | v27.15,47.78 27.46,48.1 32.54,48.1 v33.18,47.47
PC8  (via drill 0.35)
  Top 0.152: v26.19,48.42 v26.19,53.98 | v35.72,46.83 35.72,44.29 STM32-BREAKOUT.20
  Bottom 0.152: v26.19,53.98 26.19,52.7 IC1.39 | v26.19,48.42 34.13,48.42 v35.72,46.83
PC10  (via drill 0.35)
  Top 0.152: v18.26,55.4 18.26,56.52 17.94,56.83 16.19,56.83 v16.19,51.75
  Bottom 0.152: v18.26,55.4 18.41,55.56 19.53,55.56 IC1.51 | v16.19,51.75 14.13,49.69 12.54,49.69 11.59,48.74 10.32,48.74 10,48.42 10,44.29 11.91,44.29 12.86,43.34 12.86,42.23 13.34,42.23 15.08,40.48 47.62,40.48 49.21,42.07 50.96,42.07 STM32-BREAKOUT.8
PC13  (via drill 0.35)
  Top 0.152: v21.91,65.56 21.91,69.37 28.1,75.56 31.11,75.56 v31.11,85.57 | v57.15,78.11 STM32-BREAKOUT.3
  Bottom 0.152: R7.2 C19.1 48.06,85.22 | 48.06,85.22 STMUSER.P$2 46.2,87.63 44.93,88.9 31.75,88.9 31.75,87.15 31.11,86.52 v31.11,85.57 | v21.91,65.56 22.07,65.56 22.07,64.29 IC1.2 | v57.15,78.11 57.15,81.6 58.9,81.6 64.29,87 64.29,89.38 52.23,89.38 48.1,85.25 48.06,85.22
PC14  (via drill 0.35)
  Top 0.152: v21.27,66.36 20.48,67.15 20.48,75.25 23.5,78.26 30,78.26 v30,76.2 | v40.8,71.91 v36.2,76.52 | v48.9,70.48 54.61,64.77 STM32-BREAKOUT.5
  Bottom 0.152: v21.27,66.36 22.54,66.36 22.54,64.29 IC1.3 | v30,76.2 30.32,76.52 v36.2,76.52 | v40.8,71.91 42.23,70.48 v48.9,70.48
PC15  (via drill 0.35)
  Top 0.152: v23.34,62.86 22.86,63.34 22.86,66.99 22.54,67.31 22.54,68.58 v26.51,72.55 | v36.35,68.42 v32.23,72.55 | v48.9,67.94 52.07,64.77 STM32-BREAKOUT.7
  Bottom 0.152: v23.34,62.86 23.18,62.86 23.18,64.14 IC1.4 | v32.23,72.55 v26.51,72.55 | v36.35,68.42 36.83,67.94 v48.9,67.94
SD1  (via drill 0.35)
  Top 0.152: v21.75,20.48 24.29,17.94 24.29,4.92 ESP-BREAKOUT.22
  Bottom 0.152: v21.75,20.48 20.95,20.48 20.48,20.95 U1.22
SD2  (via drill 0.35)
  Top 0.152: v30.32,19.05 30.48,18.89 ESP-BREAKOUT.17
  Bottom 0.152: v30.32,19.05 22.54,26.83 20.95,26.83 20.48,27.3 U1.17
SD3  (via drill 0.35)
  Top 0.152: v29.37,19.05 29.37,4.92 ESP-BREAKOUT.18
  Bottom 0.152: v29.37,19.05 22.86,25.56 20.95,25.56 20.48,26.03 U1.18
SD_CS  (via drill 0.35)
  Top 0.152: v34.13,58.74 33.66,58.26 33.66,48.89 v32.23,47.47 | U$1.SD_CS 12.06,60.33 12.06,54.45 13.65,52.86 13.65,50.01 11.43,47.78 STM32-BREAKOUT.39
  Bottom 0.152: v34.13,58.74 33.97,58.9 32.23,58.9 32.07,58.74 31.27,58.74 IC1.24 | v32.23,47.47 31.91,47.78 28.1,47.78 27.46,47.15 23.65,47.15 23.34,47.47 20,47.47 19.68,47.15 17.14,47.15 16.83,46.83 12.54,46.83 STM32-BREAKOUT.39
SDO  (via drill 0.35)
  Top 0.152: v21.75,21.75 25.4,18.1 ESP-BREAKOUT.21
  Bottom 0.152: v21.75,21.75 20.95,21.75 20.48,22.22 U1.21
SENSOR_VN  (via drill 0.35)
  Top 0.152: v7.62,27.78 8.73,26.67 8.73,3.65 10.95,1.43 44.61,1.43 44.61,5.24 ESP-BREAKOUT.5
  Bottom 0.152: v7.62,27.78 7.62,33.02 U1.5
SENSOR_VP  (via drill 0.35)
  Top 0.152: v34.61,24.13 v23.02,35.72
  Bottom 0.152: v23.02,35.72 6.35,35.72 6.35,33.18 U1.4 | v34.61,24.13 51.91,6.83 51.91,2.7 49.37,2.7 ESP-BREAKOUT.4
SPI2_LCD_MOSI  (via drill 0.35)
  Top 0.152: v26.51,61.28 26.35,61.12 26.35,55.72 26.19,55.56 26.19,54.93 26.83,54.29 v26.83,49.69 | U$1.SDA 57.78,64.14 v57.78,62.71 | v37.15,52.55 36.83,52.23 STM32-BREAKOUT.19
  Bottom 0.152: v26.51,61.28 26.67,61.28 26.67,64.14 IC1.11 | v26.83,49.69 27.15,50.01 33.5,50.01 36.83,46.67 STM32-BREAKOUT.19 | v57.78,62.71 47.62,52.55 v37.15,52.55
SPI2_LCD_SCK  (via drill 0.35)
  Top 0.152: v29.84,55.72 29.21,56.36 29.21,58.74 32.54,62.07 v32.54,63.98 | STM32-BREAKOUT.32 22.23,42.55 v22.23,39.85
  Bottom 0.152: v29.84,55.72 30.32,56.2 31.11,56.2 IC1.29 | v32.54,63.98 34.77,66.2 63.98,66.2 | 63.98,66.2 64.61,66.83 64.61,72.39 U$1.SCK | v22.23,39.85 22.54,40.16 47.78,40.16 49.37,41.75 52.23,41.75 53.5,43.02 53.5,55.25 59.53,55.25 62.87,58.58 63.98,58.58 64.61,59.21 64.61,66.2 63.98,66.2
SPI3_ESP_MISO  (via drill 0.35)
  Top 0.152: v17.62,56.2 17.46,56.04 17.46,54.93 | 17.46,54.93 17.46,46.35 17.62,46.2 17.62,30.32 v19.05,28.89 | ESP-BREAKOUT.16 31.91,4.92 v31.91,19.05 | STM32-BREAKOUT.6 54.29,42.86 v54.29,37.62 | U$1.SD_MISO 12.7,64.77 v12.7,56.52 | 17.46,54.93 v16.83,54.93
  Bottom 0.152: v17.62,56.2 19.53,56.2 IC1.52 | v19.05,28.89 19.37,28.58 U1.16 22.38,28.58 30.16,20.8 | 30.16,20.8 v31.91,19.05 | v54.29,37.62 41.43,24.77 34.13,24.77 30.16,20.8 | v12.7,56.52 14.29,54.93 v16.83,54.93
SPI3_ESP_MOSI  (via drill 0.35)
  Top 0.152: v16.83,67.94 16.83,64.29 18.73,62.39 18.73,58.9 v20.95,56.67 17.78,53.5 17.78,46.51 17.94,46.35 17.94,35.56 v19.05,34.45 | ESP-BREAKOUT.14 34.45,4.92 34.45,23.34 v32.38,25.4
  Bottom 0.152: v20.95,56.67 19.68,56.67 IC1.53 | v16.83,67.94 16.51,67.63 13.02,67.63 U$1.SD_MOSI | 19.68,33.81 20.32,34.45 32.38,34.45 | 19.68,33.81 19.05,33.18 U1.14 | 32.38,34.45 50.16,34.45 55.56,39.85 55.88,39.85 57.15,41.12 STM32-BREAKOUT.4 | 32.38,34.45 v32.38,25.4 | 19.68,33.81 v19.05,34.45
SPI3_ESP_SCK  (via drill 0.35)
  Top 0.152: v29.84,52.55 29.53,52.23 v29.53,47.15 | ESP-BREAKOUT.23 22.86,18.1 v21.75,19.21 18.41,22.54 18.41,27.3 | v13.97,68.26 14.92,67.31 14.92,53.98 15.56,53.34 15.56,46.35 15.4,46.2 15.4,32.07 18.41,29.05 18.41,27.3 | STM32-BREAKOUT.30 23.5,42.55 23.5,38.26 19.68,34.45 19.68,28.58 18.41,27.3
  Bottom 0.152: v29.84,52.55 29.21,52.55 IC1.33 | v29.53,47.15 29.21,46.83 26.19,46.83 25.24,45.88 25.24,43.18 STM32-BREAKOUT.30 | v21.75,19.21 20.95,19.21 20.48,19.68 U1.23 | U$1.SD_SCK 11.75,68.26 v13.97,68.26
SYS_JTCK_SWCLK  (via drill 0.35)
  Top 0.152: v18.41,53.02 v19.37,53.98 | v11.43,56.52 10.79,55.88 6.35,55.88 6.35,71.12 LINK1.SWDCLK
  Bottom 0.152: v19.37,53.98 19.53,53.98 19.53,54.61 IC1.49 | v18.41,53.02 17.14,54.29 13.65,54.29 v11.43,56.52
SYS_JTMS_SWDIO  (via drill 0.35)
  Top 0.152: v13.65,49.05 13.97,49.37 13.97,59.53 13.02,60.48 13.02,71.6 v9.21,75.41
  Bottom 0.152: v13.65,49.05 23.02,49.05 23.02,51.59 22.7,51.91 22.7,52.55 IC1.46 | v9.21,75.41 8.57,76.04 3.97,76.04 LINK1.SWDIO
USART1_RX
  Bottom 0.152: STM32-BREAKOUT.12 45.88,43.18 45.88,45.88 41.43,50.32 24.13,50.32 24.13,52.55 IC1.43
USART1_TX  (via drill 0.35)
  Top 0.152: v24.77,53.98 25.24,53.5 25.24,44.13 25.56,43.81 25.56,42.7 v27.15,41.12
  Bottom 0.152: v24.77,53.98 24.77,52.7 IC1.42 | v27.15,41.12 27.46,41.43 39.21,41.43 40.8,43.02 40.8,44.29 43.34,44.29 STM32-BREAKOUT.14
USB_DM  (via drill 0.35)
  Top 0.152: v10.64,48.1 5.71,53.02 v5.71,67.63 | v2.54,69.85 2.22,70.17 2.22,79.38 5.71,82.87 9.05,82.87 9.84,83.66 12.7,83.66 12.7,84.93 USB.D+
  Bottom 0.152: v10.64,48.1 16.83,48.1 17.14,47.78 19.37,47.78 19.68,48.1 25.08,48.1 25.08,49.05 24.77,49.37 23.65,49.37 23.65,52.55 IC1.44 | v5.71,67.63 3.49,69.85 v2.54,69.85
USB_DP  (via drill 0.35)
  Top 0.152: v19.05,52.23 v20,53.18 | v10.48,56.52 7.94,59.05 v7.94,78.11 | v7.3,79.53 8.1,80.33 8.1,81.44 10,83.34 13.34,83.34 13.34,84.93 USB.D-
  Bottom 0.152: v20,53.18 20.48,53.66 23.18,53.66 23.18,52.7 IC1.45 | v19.05,52.23 18.89,52.39 14.61,52.39 v10.48,56.52 | v7.94,78.11 7.94,78.9 v7.3,79.53
VCC  (via drill 0.35)
  Bottom 0.152: VDO.4 25.46,76.43 C4.1 21.62,72.58 21.62,72.56 21.48,72.43 17.82,72.43 v17.78,72.39 | C10.1 20.11,65.83 | 20.11,65.83 21.65,64.29 IC1.1 | 33.13,62.34 29.03,66.64 29.03,70.19 29.08,71.12 23.75,71.12 22.48,67.94 v21.21,67.31 | 33.13,62.34 C6.1 | C6.1 34.29,61.13 | C9.1 16.15,62.17 | 16.15,62.17 IC1.64 | IC1.48 21.65,51.28 C5.1 12.7,60.96 12.7,63.5 16.24,63.52 | v17.78,72.39 8.89,72.39 8.14,71.87 8.14,50.67 8.29,50.52 | 8.29,50.52 8.89,49.92 8.89,44.13 | 8.89,44.13 8.89,36.83 C13.1 U1.2 | v44.45,77.47 38.1,69.85 31.75,69.85 31.75,71.88 18.29,71.88 v17.78,72.39 | C6.1 31.18,61.21 IC1.19 | v21.21,67.31 C8.1 20.35,70.16 20.35,70.19 19.41,71.12 17.78,71.12 v17.78,72.39 | v21.21,67.31 20.11,65.83 | v21.21,67.31 16.51,67.31 16.24,63.52 | 16.24,63.52 16.15,62.17 | v21.21,67.31 22.86,67.31 22.98,67.43 22.98,68.14 24.51,69.66 FB1.1 | 33.13,62.34 38.1,62.36 38.1,54.61 35.34,54.61 C7.1 33.17,54.67 IC1.32 | v44.45,77.47 46.49,77.47 R7.1 | v44.45,77.47 49.67,77.47 | 49.67,77.47 R8.1 | v44.45,77.47 44.45,86.36 M10.10 | 49.67,77.47 66.04,77.47 66.04,57.15 U$1.VCC 63.5,54.93 65.52,52.91 65.52,50.28 62.19,47.68 | 62.19,47.68 STM32-BREAKOUT.1 | 8.89,44.13 7.62,44.13 R1.2 | 8.29,50.52 6.99,49.21 R4.2 | ESP-BREAKOUT.2 49.69,4.92 47.78,4.92 47.15,4.29 47.15,2.38 52.07,2.38 61.91,12.22 61.91,36.2 62.23,36.2 62.55,36.51 62.55,47.62 62.23,47.62 62.19,47.68
VCC0  (via drill 0.35)
  Top 0.152: USB.+5V 14.02,83.31 | 14.02,83.31 13.97,83.31 | 14.02,83.31 v14.1,83.31
  Bottom 0.152: 17.78,83.82 17.78,83.31 | CHARGING_CIRCUT.4 17.34,81.36 arc-90 R2.2 17.78,83.82 | v14.1,83.31 14.61,83.82 17.57,83.82 C2.1 17.78,83.82
VCC1  (via drill 0.35)
  Top 0.152: v13.82,80.01 v23.5,80.01
  Bottom 0.152: CN1.1 8.14,81.13 8.14,79.17 12.22,75.1 12.7,75.1 | 12.7,75.1 C1.1 17.23,75.1 CHARGING_CIRCUT.3 | v13.82,80.01 13.19,78.75 12.74,77.67 12.74,76.2 12.7,75.1 | v23.5,80.01 24.25,80.01 RESETTABLE-FUSE.1
VDDA
  Bottom 0.152: FB1.2 25.44,69.34 C11.1 C12.1 27.28,66.49 27.28,66.47 27.65,66.09 IC1.13
VIN  (via drill 0.35)
  Top 0.152: v30.35,78.87 13.09,78.74 11.95,77.47 9.71,77.6 8.57,78.74 LINK1.VCC 3.81,77.85 2.64,76.68 2.64,70.64 3.81,69.47 ESP32PH.VCC | v33.02,78.74 60.57,78.74 61.72,77.6 63.95,77.6 65.09,78.74 66.04,78.74 66.04,33.02 | 60.96,31.75 66.04,31.75 66.04,33.02 | 60.96,31.75 58.42,31.75 | 58.42,31.75 52.07,31.75 | 52.07,31.75 49.53,31.75 | 49.53,31.75 44.45,31.75 | 44.45,31.75 43.18,31.75 | 43.18,31.75 38.1,31.75 | 38.1,31.75 35.56,31.75 35.56,16.51 36.83,16.51 | 36.83,16.51 41.91,16.51 | 41.91,16.51 44.45,16.51 | 44.45,16.51 49.53,16.51 | 49.53,16.51 52.07,16.51 | 52.07,16.51 58.42,16.51 | 58.42,16.51 59.69,16.51 | 59.69,16.51 64.77,16.51 | 64.77,16.51 66.04,16.51 | 66.04,33.02 65.37,33.02 C21.1 64.23,34.16 U$7.1 | 60.96,31.75 C25.1 U$9.1 | 58.42,31.75 C20.1 U$6.1 | 52.07,31.75 C24.1 U$10.1 | 49.53,31.75 C14.1 U$5.1 | U$11.1 C23.1 44.45,31.75 | 43.18,31.75 C31.1 U$8.1 | U$12.1 C22.1 38.1,31.75 | U$13.1 C26.1 41.91,16.51 | 36.83,16.51 C34.1 U$20.1 | U$19.1 C33.1 44.45,16.51 | 49.53,16.51 C27.1 U$14.1 | U$18.1 C32.1 52.07,16.51 | U$15.1 C28.1 58.42,16.51 | 59.69,16.51 C30.1 U$17.1 | 64.77,16.51 C29.1 U$16.1
  Bottom 0.152: 27.73,79.92 RESETTABLE-FUSE.2 v30.35,78.87 C3.2 v33.02,78.74 | v33.02,78.74 arc-90 36.83,77.47 36.83,71.12 33.02,71.12 arc-90 32.84,71.3 P1.2 | v33.02,78.74 VDO.6
VIN-EN
  Bottom 0.152: P1.C 30.39,74.93 VDO.1